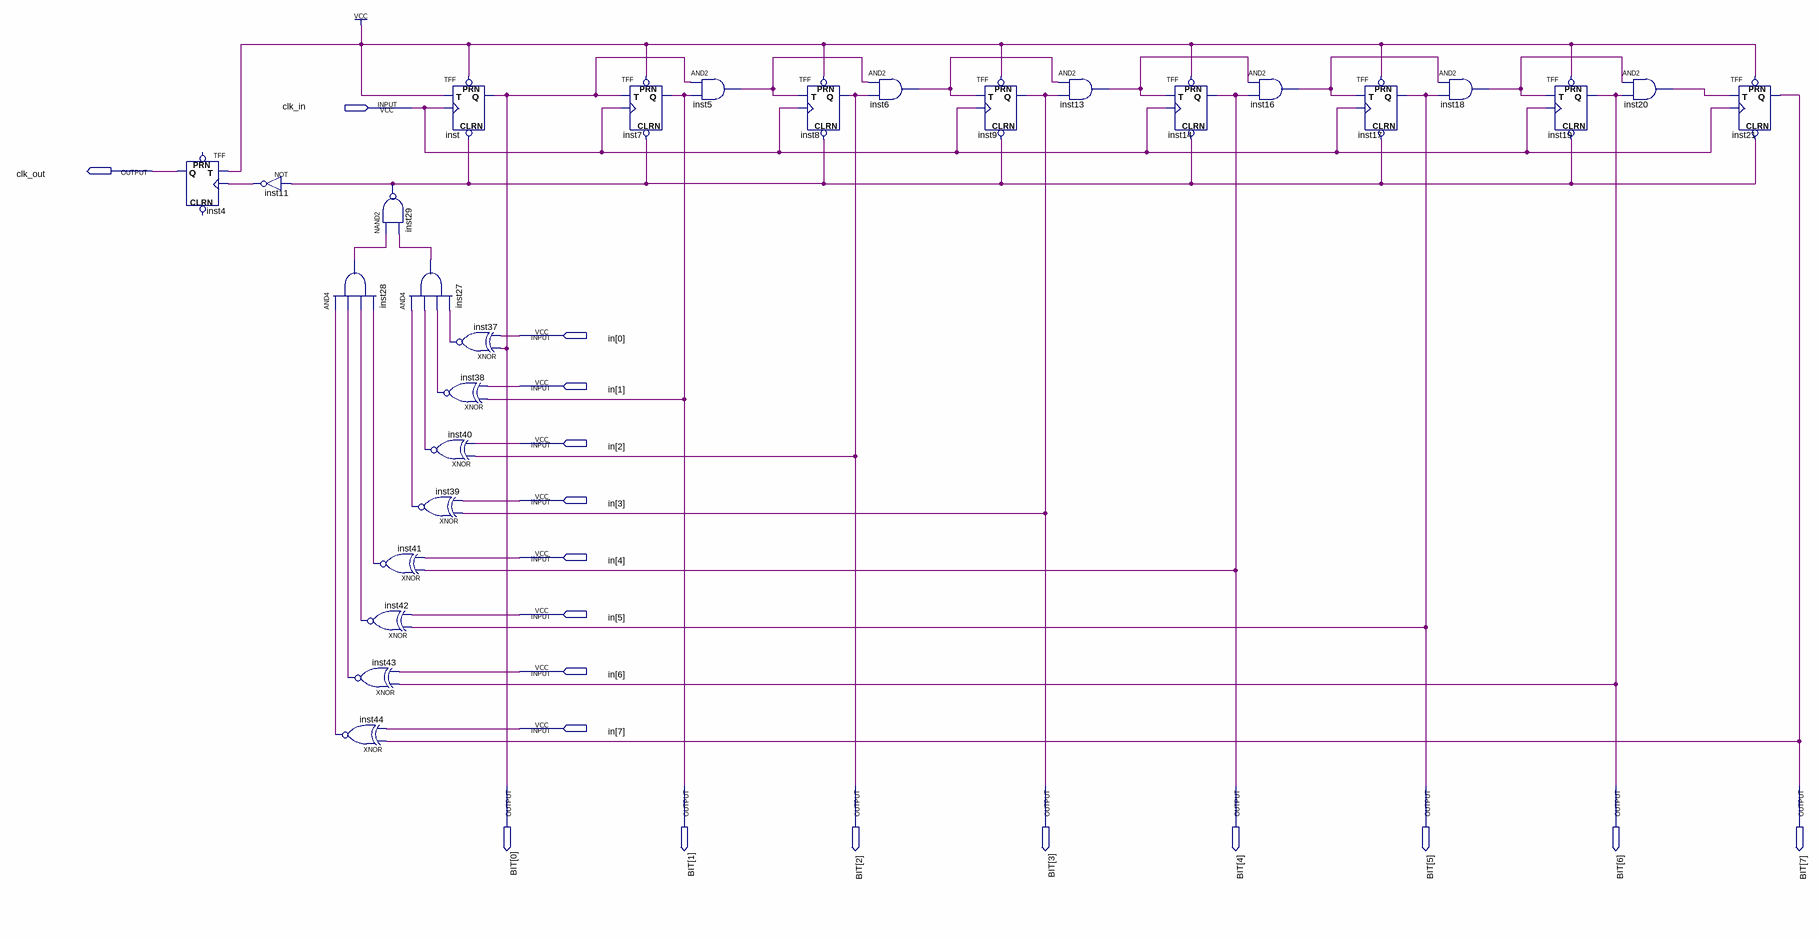
[diagram p0: schematic sheet]
// Quartus schematic contador_async.bdf as structural Verilog: 27 symbols, 18 pins
module contador_async (
  input  clk_in,
  input  [7:0] in,
  output clk_out,
  output [7:0] BIT
);

  wire inst5_out, inst6_out, inst11_out, inst13_out, inst16_out, inst18_out, inst20_out, inst27_out,
       inst28_out, inst29_out, inst37_out, inst38_out, inst39_out, inst40_out, inst41_out, inst42_out,
       inst43_out, inst44_out;

  TFF inst4 (.T(1'b1), .CLK(inst11_out), .Q(clk_out));  // open: PRN, CLRN
  not inst11 (inst11_out, inst29_out);
  and inst28 (inst28_out, inst44_out, inst43_out, inst42_out, inst41_out);
  nand inst29 (inst29_out, inst28_out, inst27_out);
  xnor inst41 (inst41_out, BIT[4], in[4]);
  xnor inst42 (inst42_out, BIT[5], in[5]);
  xnor inst43 (inst43_out, BIT[6], in[6]);
  xnor inst44 (inst44_out, BIT[7], in[7]);
  and inst27 (inst27_out, inst39_out, inst40_out, inst38_out, inst37_out);
  xnor inst40 (inst40_out, BIT[2], in[2]);
  xnor inst39 (inst39_out, BIT[3], in[3]);
  TFF inst (.PRN(1'b1), .CLRN(inst29_out), .T(1'b1), .CLK(clk_in), .Q(BIT[0]));
  xnor inst37 (inst37_out, BIT[0], in[0]);
  xnor inst38 (inst38_out, BIT[1], in[1]);
  TFF inst7 (.PRN(1'b1), .CLRN(inst29_out), .T(BIT[0]), .CLK(clk_in), .Q(BIT[1]));
  and inst5 (inst5_out, BIT[0], BIT[1]);
  TFF inst8 (.PRN(1'b1), .CLRN(inst29_out), .T(inst5_out), .CLK(clk_in), .Q(BIT[2]));
  and inst6 (inst6_out, inst5_out, BIT[2]);
  TFF inst9 (.PRN(1'b1), .CLRN(inst29_out), .T(inst6_out), .CLK(clk_in), .Q(BIT[3]));
  and inst13 (inst13_out, inst6_out, BIT[3]);
  TFF inst14 (.PRN(1'b1), .CLRN(inst29_out), .T(inst13_out), .CLK(clk_in), .Q(BIT[4]));
  and inst16 (inst16_out, inst13_out, BIT[4]);
  TFF inst17 (.PRN(1'b1), .CLRN(inst29_out), .T(inst16_out), .CLK(clk_in), .Q(BIT[5]));
  and inst18 (inst18_out, inst16_out, BIT[5]);
  TFF inst19 (.PRN(1'b1), .CLRN(inst29_out), .T(inst18_out), .CLK(clk_in), .Q(BIT[6]));
  and inst20 (inst20_out, inst18_out, BIT[6]);
  TFF inst21 (.PRN(1'b1), .CLRN(inst29_out), .T(inst20_out), .CLK(clk_in), .Q(BIT[7]));
endmodule
